# Altium project PCB_Project.PrjPcb
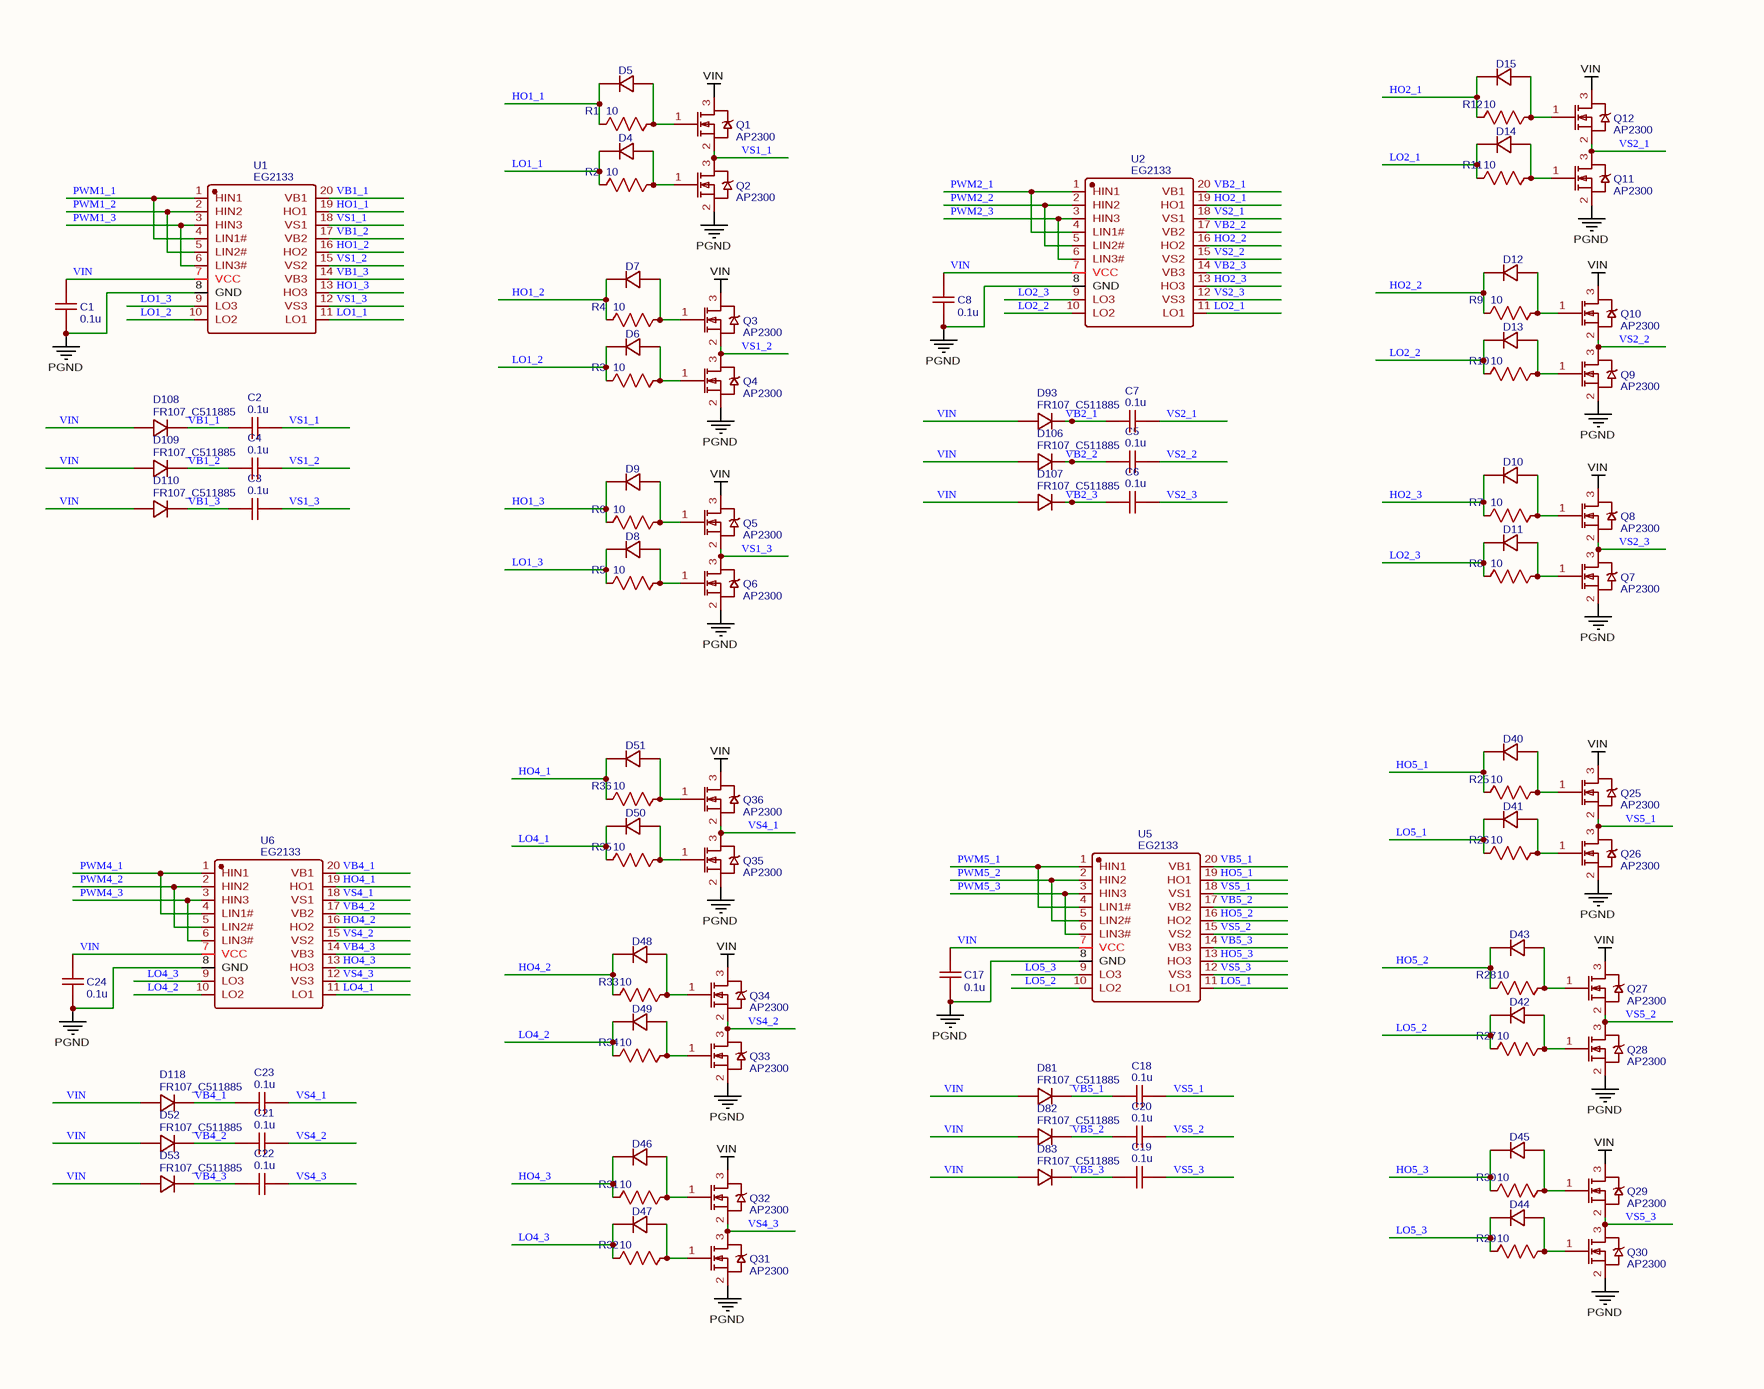
[diagram p0: quark_foc_driver.schdoc, top left]
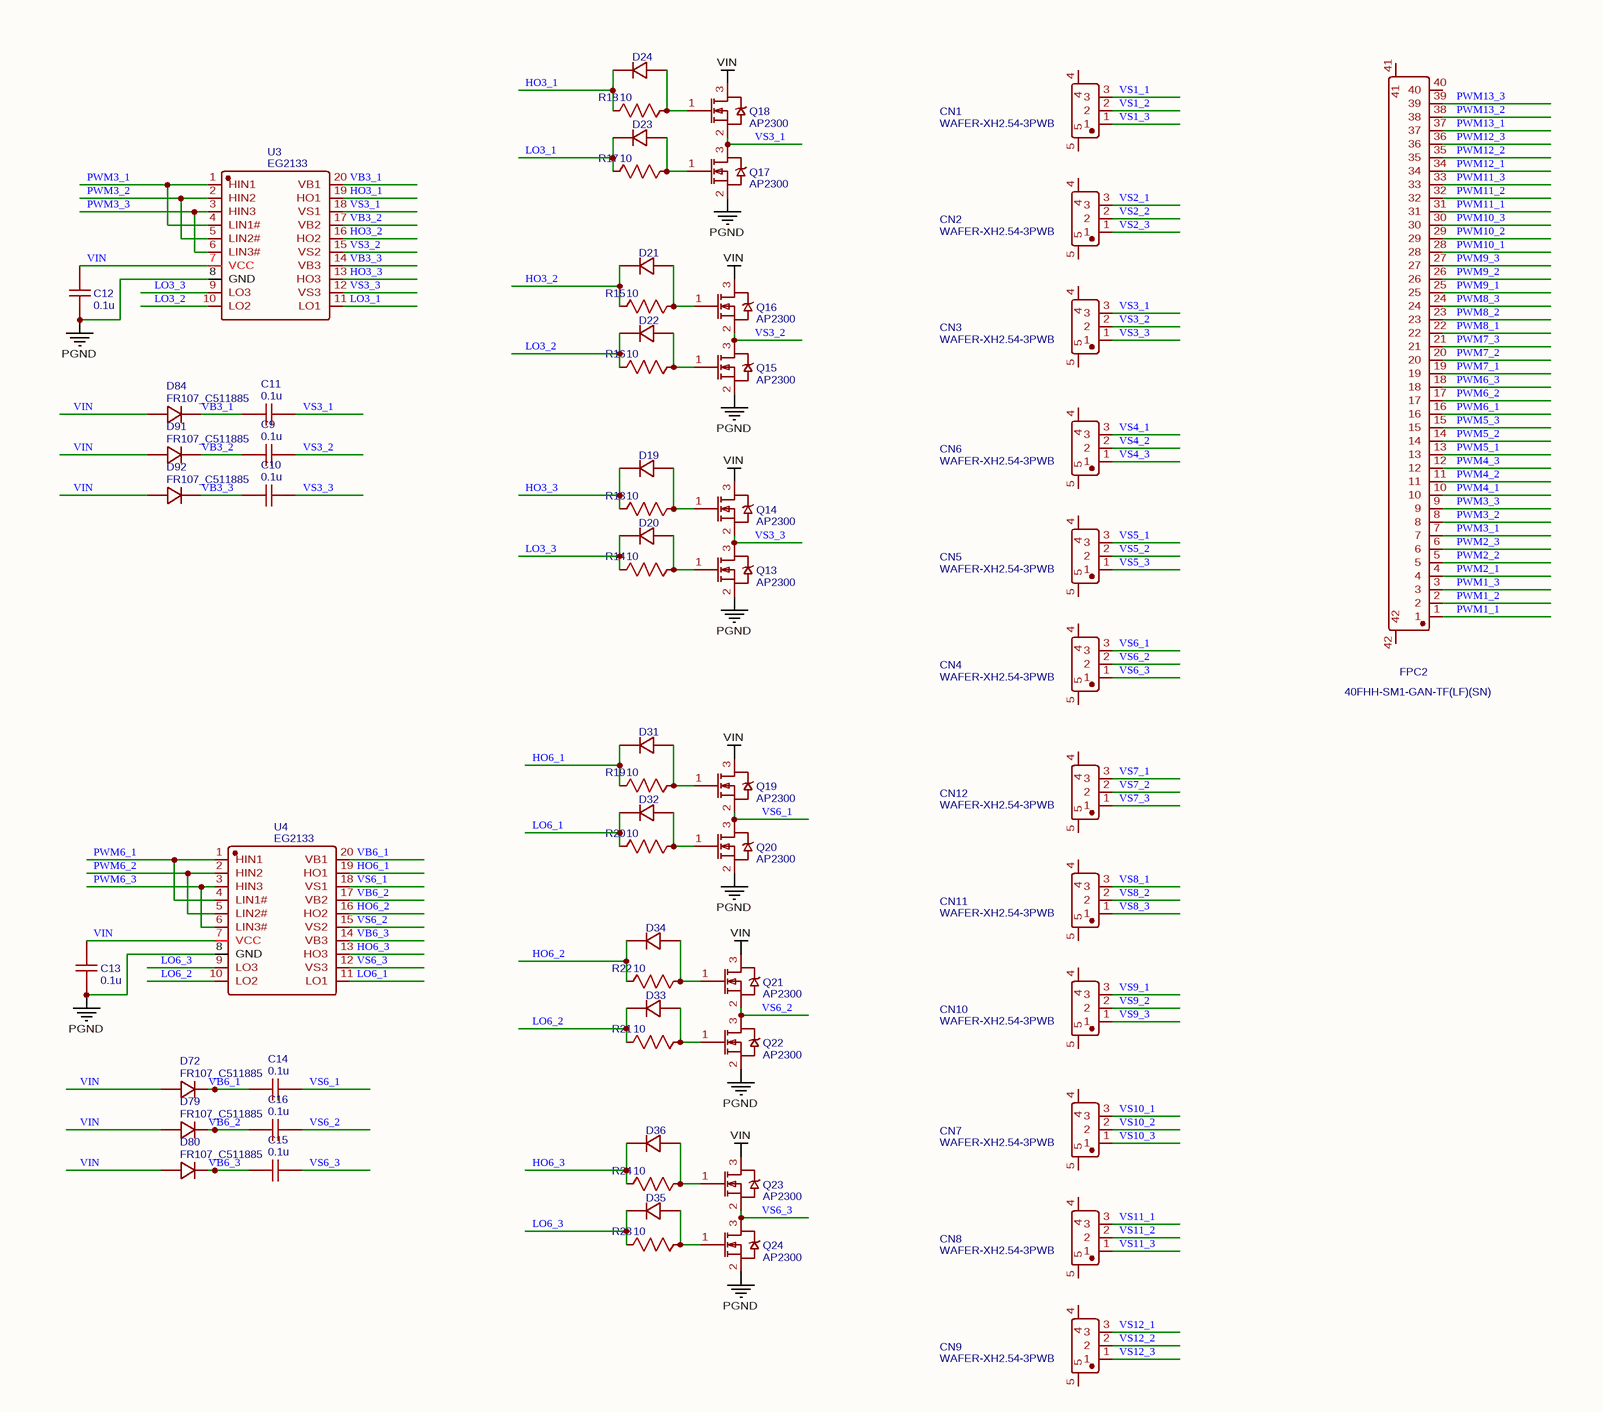
[diagram p1: quark_foc_driver.schdoc, top right]
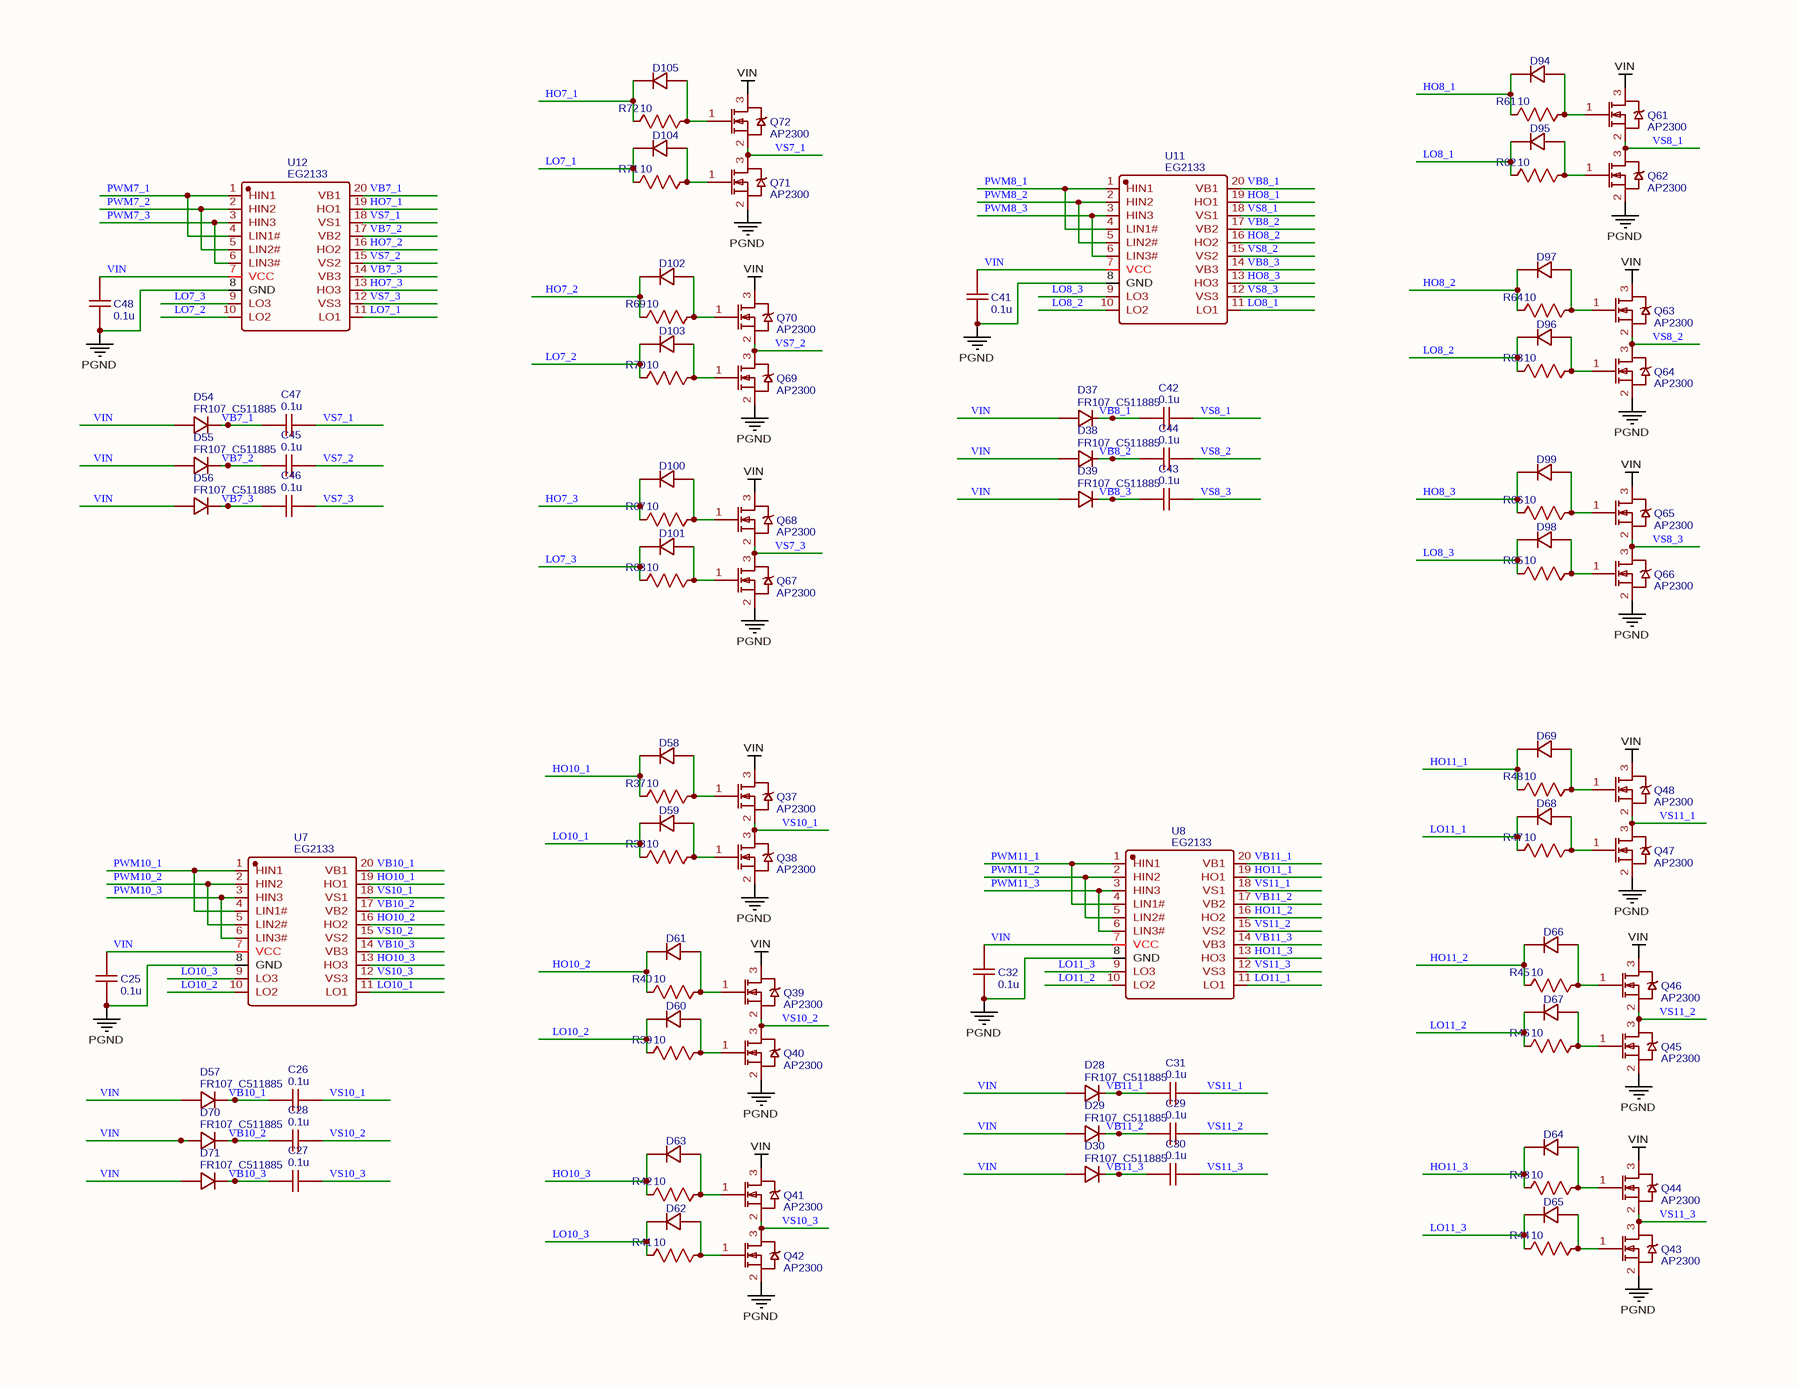
[diagram p2: quark_foc_driver.schdoc, bottom left]
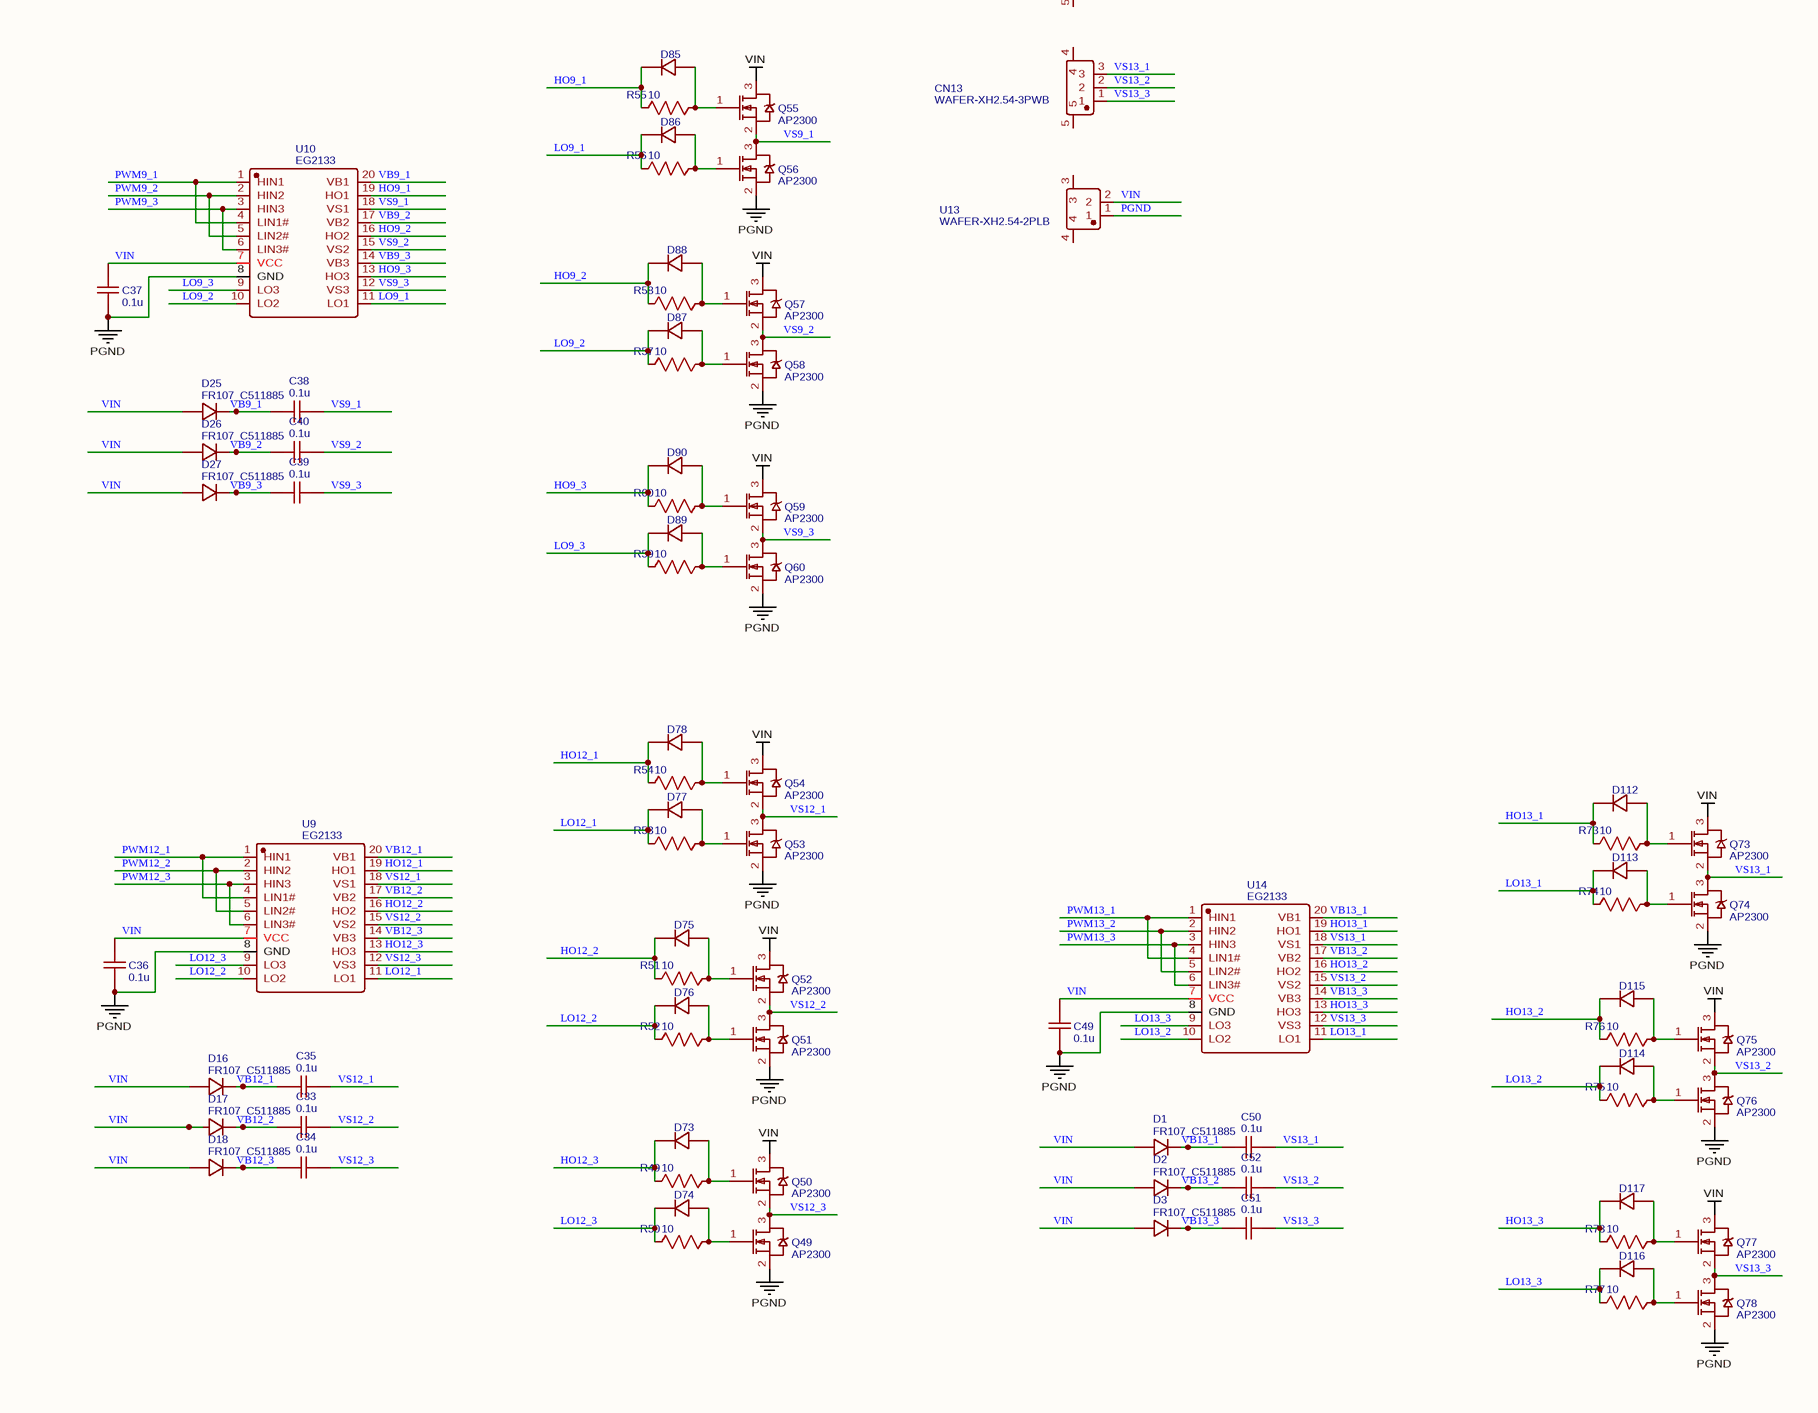
[diagram p3: quark_foc_driver.schdoc, bottom right]
1 sheet, 353 parts. Net scope: global (net labels, ports and power ports of the same name join across sheets).
Board file: quark_dog_driver.PcbDoc

## Sheet quark_foc_driver.schdoc
size 697 x 526 mm; SheetNumber: 1; SheetTotal: 1

### Parts
C1  0.1u  [C0603]
C2  0.1u  [C0603]
C3  0.1u  [C0603]
C4  0.1u  [C0603]
C5  0.1u  [C0603]
C6  0.1u  [C0603]
C7  0.1u  [C0603]
C8  0.1u  [C0603]
C9  0.1u  [C0603]
C10  0.1u  [C0603]
C11  0.1u  [C0603]
C12  0.1u  [C0603]
C13  0.1u  [C0603]
C14  0.1u  [C0603]
C15  0.1u  [C0603]
C16  0.1u  [C0603]
C17  0.1u  [C0603]
C18  0.1u  [C0603]
C19  0.1u  [C0603]
C20  0.1u  [C0603]
C21  0.1u  [C0603]
C22  0.1u  [C0603]
C23  0.1u  [C0603]
C24  0.1u  [C0603]
C25  0.1u  [C0603]
C26  0.1u  [C0603]
C27  0.1u  [C0603]
C28  0.1u  [C0603]
C29  0.1u  [C0603]
C30  0.1u  [C0603]
C31  0.1u  [C0603]
C32  0.1u  [C0603]
C33  0.1u  [C0603]
C34  0.1u  [C0603]
C35  0.1u  [C0603]
C36  0.1u  [C0603]
C37  0.1u  [C0603]
C38  0.1u  [C0603]
C39  0.1u  [C0603]
C40  0.1u  [C0603]
C41  0.1u  [C0603]
C42  0.1u  [C0603]
C43  0.1u  [C0603]
C44  0.1u  [C0603]
C45  0.1u  [C0603]
C46  0.1u  [C0603]
C47  0.1u  [C0603]
C48  0.1u  [C0603]
C49  0.1u  [C0603]
C50  0.1u  [C0603]
C51  0.1u  [C0603]
C52  0.1u  [C0603]
CN1  WAFER-XH2.54-3PWB  [CONN-SMD_3P-P2.50_XUNPU_WAFER-XH2.54-3PWB]
CN2  WAFER-XH2.54-3PWB  [CONN-SMD_3P-P2.50_XUNPU_WAFER-XH2.54-3PWB]
CN3  WAFER-XH2.54-3PWB  [CONN-SMD_3P-P2.50_XUNPU_WAFER-XH2.54-3PWB]
CN4  WAFER-XH2.54-3PWB  [CONN-SMD_3P-P2.50_XUNPU_WAFER-XH2.54-3PWB]
CN5  WAFER-XH2.54-3PWB  [CONN-SMD_3P-P2.50_XUNPU_WAFER-XH2.54-3PWB]
CN6  WAFER-XH2.54-3PWB  [CONN-SMD_3P-P2.50_XUNPU_WAFER-XH2.54-3PWB]
CN7  WAFER-XH2.54-3PWB  [CONN-SMD_3P-P2.50_XUNPU_WAFER-XH2.54-3PWB]
CN8  WAFER-XH2.54-3PWB  [CONN-SMD_3P-P2.50_XUNPU_WAFER-XH2.54-3PWB]
CN9  WAFER-XH2.54-3PWB  [CONN-SMD_3P-P2.50_XUNPU_WAFER-XH2.54-3PWB]
CN10  WAFER-XH2.54-3PWB  [CONN-SMD_3P-P2.50_XUNPU_WAFER-XH2.54-3PWB]
CN11  WAFER-XH2.54-3PWB  [CONN-SMD_3P-P2.50_XUNPU_WAFER-XH2.54-3PWB]
CN12  WAFER-XH2.54-3PWB  [CONN-SMD_3P-P2.50_XUNPU_WAFER-XH2.54-3PWB]
CN13  WAFER-XH2.54-3PWB  [CONN-SMD_3P-P2.50_XUNPU_WAFER-XH2.54-3PWB]
D1  FR107_C511885  [SOD-123_L2.8-W1.8-LS3.7-RD]
D2  FR107_C511885  [SOD-123_L2.8-W1.8-LS3.7-RD]
D3  FR107_C511885  [SOD-123_L2.8-W1.8-LS3.7-RD]
D4  1N4148W_C176288  [SOD-123_L2.8-W1.8-LS3.7-RD]  (value not drawn)
D5  1N4148W_C176288  [SOD-123_L2.8-W1.8-LS3.7-RD]  (value not drawn)
D6  1N4148W_C176288  [SOD-123_L2.8-W1.8-LS3.7-RD]  (value not drawn)
D7  1N4148W_C176288  [SOD-123_L2.8-W1.8-LS3.7-RD]  (value not drawn)
D8  1N4148W_C176288  [SOD-123_L2.8-W1.8-LS3.7-RD]  (value not drawn)
D9  1N4148W_C176288  [SOD-123_L2.8-W1.8-LS3.7-RD]  (value not drawn)
D10  1N4148W_C176288  [SOD-123_L2.8-W1.8-LS3.7-RD]  (value not drawn)
D11  1N4148W_C176288  [SOD-123_L2.8-W1.8-LS3.7-RD]  (value not drawn)
D12  1N4148W_C176288  [SOD-123_L2.8-W1.8-LS3.7-RD]  (value not drawn)
D13  1N4148W_C176288  [SOD-123_L2.8-W1.8-LS3.7-RD]  (value not drawn)
D14  1N4148W_C176288  [SOD-123_L2.8-W1.8-LS3.7-RD]  (value not drawn)
D15  1N4148W_C176288  [SOD-123_L2.8-W1.8-LS3.7-RD]  (value not drawn)
D16  FR107_C511885  [SOD-123_L2.8-W1.8-LS3.7-RD]
D17  FR107_C511885  [SOD-123_L2.8-W1.8-LS3.7-RD]
D18  FR107_C511885  [SOD-123_L2.8-W1.8-LS3.7-RD]
D19  1N4148W_C176288  [SOD-123_L2.8-W1.8-LS3.7-RD]  (value not drawn)
D20  1N4148W_C176288  [SOD-123_L2.8-W1.8-LS3.7-RD]  (value not drawn)
D21  1N4148W_C176288  [SOD-123_L2.8-W1.8-LS3.7-RD]  (value not drawn)
D22  1N4148W_C176288  [SOD-123_L2.8-W1.8-LS3.7-RD]  (value not drawn)
D23  1N4148W_C176288  [SOD-123_L2.8-W1.8-LS3.7-RD]  (value not drawn)
D24  1N4148W_C176288  [SOD-123_L2.8-W1.8-LS3.7-RD]  (value not drawn)
D25  FR107_C511885  [SOD-123_L2.8-W1.8-LS3.7-RD]
D26  FR107_C511885  [SOD-123_L2.8-W1.8-LS3.7-RD]
D27  FR107_C511885  [SOD-123_L2.8-W1.8-LS3.7-RD]
D28  FR107_C511885  [SOD-123_L2.8-W1.8-LS3.7-RD]
D29  FR107_C511885  [SOD-123_L2.8-W1.8-LS3.7-RD]
D30  FR107_C511885  [SOD-123_L2.8-W1.8-LS3.7-RD]
D31  1N4148W_C176288  [SOD-123_L2.8-W1.8-LS3.7-RD]  (value not drawn)
D32  1N4148W_C176288  [SOD-123_L2.8-W1.8-LS3.7-RD]  (value not drawn)
D33  1N4148W_C176288  [SOD-123_L2.8-W1.8-LS3.7-RD]  (value not drawn)
D34  1N4148W_C176288  [SOD-123_L2.8-W1.8-LS3.7-RD]  (value not drawn)
D35  1N4148W_C176288  [SOD-123_L2.8-W1.8-LS3.7-RD]  (value not drawn)
D36  1N4148W_C176288  [SOD-123_L2.8-W1.8-LS3.7-RD]  (value not drawn)
D37  FR107_C511885  [SOD-123_L2.8-W1.8-LS3.7-RD]
D38  FR107_C511885  [SOD-123_L2.8-W1.8-LS3.7-RD]
D39  FR107_C511885  [SOD-123_L2.8-W1.8-LS3.7-RD]
D40  1N4148W_C176288  [SOD-123_L2.8-W1.8-LS3.7-RD]  (value not drawn)
D41  1N4148W_C176288  [SOD-123_L2.8-W1.8-LS3.7-RD]  (value not drawn)
D42  1N4148W_C176288  [SOD-123_L2.8-W1.8-LS3.7-RD]  (value not drawn)
D43  1N4148W_C176288  [SOD-123_L2.8-W1.8-LS3.7-RD]  (value not drawn)
D44  1N4148W_C176288  [SOD-123_L2.8-W1.8-LS3.7-RD]  (value not drawn)
D45  1N4148W_C176288  [SOD-123_L2.8-W1.8-LS3.7-RD]  (value not drawn)
D46  1N4148W_C176288  [SOD-123_L2.8-W1.8-LS3.7-RD]  (value not drawn)
D47  1N4148W_C176288  [SOD-123_L2.8-W1.8-LS3.7-RD]  (value not drawn)
D48  1N4148W_C176288  [SOD-123_L2.8-W1.8-LS3.7-RD]  (value not drawn)
D49  1N4148W_C176288  [SOD-123_L2.8-W1.8-LS3.7-RD]  (value not drawn)
D50  1N4148W_C176288  [SOD-123_L2.8-W1.8-LS3.7-RD]  (value not drawn)
D51  1N4148W_C176288  [SOD-123_L2.8-W1.8-LS3.7-RD]  (value not drawn)
D52  FR107_C511885  [SOD-123_L2.8-W1.8-LS3.7-RD]
D53  FR107_C511885  [SOD-123_L2.8-W1.8-LS3.7-RD]
D54  FR107_C511885  [SOD-123_L2.8-W1.8-LS3.7-RD]
D55  FR107_C511885  [SOD-123_L2.8-W1.8-LS3.7-RD]
D56  FR107_C511885  [SOD-123_L2.8-W1.8-LS3.7-RD]
D57  FR107_C511885  [SOD-123_L2.8-W1.8-LS3.7-RD]
D58  1N4148W_C176288  [SOD-123_L2.8-W1.8-LS3.7-RD]  (value not drawn)
D59  1N4148W_C176288  [SOD-123_L2.8-W1.8-LS3.7-RD]  (value not drawn)
D60  1N4148W_C176288  [SOD-123_L2.8-W1.8-LS3.7-RD]  (value not drawn)
D61  1N4148W_C176288  [SOD-123_L2.8-W1.8-LS3.7-RD]  (value not drawn)
D62  1N4148W_C176288  [SOD-123_L2.8-W1.8-LS3.7-RD]  (value not drawn)
D63  1N4148W_C176288  [SOD-123_L2.8-W1.8-LS3.7-RD]  (value not drawn)
D64  1N4148W_C176288  [SOD-123_L2.8-W1.8-LS3.7-RD]  (value not drawn)
D65  1N4148W_C176288  [SOD-123_L2.8-W1.8-LS3.7-RD]  (value not drawn)
D66  1N4148W_C176288  [SOD-123_L2.8-W1.8-LS3.7-RD]  (value not drawn)
D67  1N4148W_C176288  [SOD-123_L2.8-W1.8-LS3.7-RD]  (value not drawn)
D68  1N4148W_C176288  [SOD-123_L2.8-W1.8-LS3.7-RD]  (value not drawn)
D69  1N4148W_C176288  [SOD-123_L2.8-W1.8-LS3.7-RD]  (value not drawn)
D70  FR107_C511885  [SOD-123_L2.8-W1.8-LS3.7-RD]
D71  FR107_C511885  [SOD-123_L2.8-W1.8-LS3.7-RD]
D72  FR107_C511885  [SOD-123_L2.8-W1.8-LS3.7-RD]
D73  1N4148W_C176288  [SOD-123_L2.8-W1.8-LS3.7-RD]  (value not drawn)
D74  1N4148W_C176288  [SOD-123_L2.8-W1.8-LS3.7-RD]  (value not drawn)
D75  1N4148W_C176288  [SOD-123_L2.8-W1.8-LS3.7-RD]  (value not drawn)
D76  1N4148W_C176288  [SOD-123_L2.8-W1.8-LS3.7-RD]  (value not drawn)
D77  1N4148W_C176288  [SOD-123_L2.8-W1.8-LS3.7-RD]  (value not drawn)
D78  1N4148W_C176288  [SOD-123_L2.8-W1.8-LS3.7-RD]  (value not drawn)
D79  FR107_C511885  [SOD-123_L2.8-W1.8-LS3.7-RD]
D80  FR107_C511885  [SOD-123_L2.8-W1.8-LS3.7-RD]
D81  FR107_C511885  [SOD-123_L2.8-W1.8-LS3.7-RD]
D82  FR107_C511885  [SOD-123_L2.8-W1.8-LS3.7-RD]
D83  FR107_C511885  [SOD-123_L2.8-W1.8-LS3.7-RD]
D84  FR107_C511885  [SOD-123_L2.8-W1.8-LS3.7-RD]
D85  1N4148W_C176288  [SOD-123_L2.8-W1.8-LS3.7-RD]  (value not drawn)
D86  1N4148W_C176288  [SOD-123_L2.8-W1.8-LS3.7-RD]  (value not drawn)
D87  1N4148W_C176288  [SOD-123_L2.8-W1.8-LS3.7-RD]  (value not drawn)
D88  1N4148W_C176288  [SOD-123_L2.8-W1.8-LS3.7-RD]  (value not drawn)
D89  1N4148W_C176288  [SOD-123_L2.8-W1.8-LS3.7-RD]  (value not drawn)
D90  1N4148W_C176288  [SOD-123_L2.8-W1.8-LS3.7-RD]  (value not drawn)
D91  FR107_C511885  [SOD-123_L2.8-W1.8-LS3.7-RD]
D92  FR107_C511885  [SOD-123_L2.8-W1.8-LS3.7-RD]
D93  FR107_C511885  [SOD-123_L2.8-W1.8-LS3.7-RD]
D94  1N4148W_C176288  [SOD-123_L2.8-W1.8-LS3.7-RD]  (value not drawn)
D95  1N4148W_C176288  [SOD-123_L2.8-W1.8-LS3.7-RD]  (value not drawn)
D96  1N4148W_C176288  [SOD-123_L2.8-W1.8-LS3.7-RD]  (value not drawn)
D97  1N4148W_C176288  [SOD-123_L2.8-W1.8-LS3.7-RD]  (value not drawn)
D98  1N4148W_C176288  [SOD-123_L2.8-W1.8-LS3.7-RD]  (value not drawn)
D99  1N4148W_C176288  [SOD-123_L2.8-W1.8-LS3.7-RD]  (value not drawn)
D100  1N4148W_C176288  [SOD-123_L2.8-W1.8-LS3.7-RD]  (value not drawn)
D101  1N4148W_C176288  [SOD-123_L2.8-W1.8-LS3.7-RD]  (value not drawn)
D102  1N4148W_C176288  [SOD-123_L2.8-W1.8-LS3.7-RD]  (value not drawn)
D103  1N4148W_C176288  [SOD-123_L2.8-W1.8-LS3.7-RD]  (value not drawn)
D104  1N4148W_C176288  [SOD-123_L2.8-W1.8-LS3.7-RD]  (value not drawn)
D105  1N4148W_C176288  [SOD-123_L2.8-W1.8-LS3.7-RD]  (value not drawn)
D106  FR107_C511885  [SOD-123_L2.8-W1.8-LS3.7-RD]
D107  FR107_C511885  [SOD-123_L2.8-W1.8-LS3.7-RD]
D108  FR107_C511885  [SOD-123_L2.8-W1.8-LS3.7-RD]
D109  FR107_C511885  [SOD-123_L2.8-W1.8-LS3.7-RD]
D110  FR107_C511885  [SOD-123_L2.8-W1.8-LS3.7-RD]
D112  1N4148W_C176288  [SOD-123_L2.8-W1.8-LS3.7-RD]  (value not drawn)
D113  1N4148W_C176288  [SOD-123_L2.8-W1.8-LS3.7-RD]  (value not drawn)
D114  1N4148W_C176288  [SOD-123_L2.8-W1.8-LS3.7-RD]  (value not drawn)
D115  1N4148W_C176288  [SOD-123_L2.8-W1.8-LS3.7-RD]  (value not drawn)
D116  1N4148W_C176288  [SOD-123_L2.8-W1.8-LS3.7-RD]  (value not drawn)
D117  1N4148W_C176288  [SOD-123_L2.8-W1.8-LS3.7-RD]  (value not drawn)
D118  FR107_C511885  [SOD-123_L2.8-W1.8-LS3.7-RD]
FPC2  40FHH-SM1-GAN-TF(LF)(SN)  [FPC-SMD_JST_40FHH-SM1-GAN-TF]
Q1  AP2300  [SOT-23-3_L2.9-W1.3-P0.95-LS2.4-BR]
Q2  AP2300  [SOT-23-3_L2.9-W1.3-P0.95-LS2.4-BR]
Q3  AP2300  [SOT-23-3_L2.9-W1.3-P0.95-LS2.4-BR]
Q4  AP2300  [SOT-23-3_L2.9-W1.3-P0.95-LS2.4-BR]
Q5  AP2300  [SOT-23-3_L2.9-W1.3-P0.95-LS2.4-BR]
Q6  AP2300  [SOT-23-3_L2.9-W1.3-P0.95-LS2.4-BR]
Q7  AP2300  [SOT-23-3_L2.9-W1.3-P0.95-LS2.4-BR]
Q8  AP2300  [SOT-23-3_L2.9-W1.3-P0.95-LS2.4-BR]
Q9  AP2300  [SOT-23-3_L2.9-W1.3-P0.95-LS2.4-BR]
Q10  AP2300  [SOT-23-3_L2.9-W1.3-P0.95-LS2.4-BR]
Q11  AP2300  [SOT-23-3_L2.9-W1.3-P0.95-LS2.4-BR]
Q12  AP2300  [SOT-23-3_L2.9-W1.3-P0.95-LS2.4-BR]
Q13  AP2300  [SOT-23-3_L2.9-W1.3-P0.95-LS2.4-BR]
Q14  AP2300  [SOT-23-3_L2.9-W1.3-P0.95-LS2.4-BR]
Q15  AP2300  [SOT-23-3_L2.9-W1.3-P0.95-LS2.4-BR]
Q16  AP2300  [SOT-23-3_L2.9-W1.3-P0.95-LS2.4-BR]
Q17  AP2300  [SOT-23-3_L2.9-W1.3-P0.95-LS2.4-BR]
Q18  AP2300  [SOT-23-3_L2.9-W1.3-P0.95-LS2.4-BR]
Q19  AP2300  [SOT-23-3_L2.9-W1.3-P0.95-LS2.4-BR]
Q20  AP2300  [SOT-23-3_L2.9-W1.3-P0.95-LS2.4-BR]
Q21  AP2300  [SOT-23-3_L2.9-W1.3-P0.95-LS2.4-BR]
Q22  AP2300  [SOT-23-3_L2.9-W1.3-P0.95-LS2.4-BR]
Q23  AP2300  [SOT-23-3_L2.9-W1.3-P0.95-LS2.4-BR]
Q24  AP2300  [SOT-23-3_L2.9-W1.3-P0.95-LS2.4-BR]
Q25  AP2300  [SOT-23-3_L2.9-W1.3-P0.95-LS2.4-BR]
Q26  AP2300  [SOT-23-3_L2.9-W1.3-P0.95-LS2.4-BR]
Q27  AP2300  [SOT-23-3_L2.9-W1.3-P0.95-LS2.4-BR]
Q28  AP2300  [SOT-23-3_L2.9-W1.3-P0.95-LS2.4-BR]
Q29  AP2300  [SOT-23-3_L2.9-W1.3-P0.95-LS2.4-BR]
Q30  AP2300  [SOT-23-3_L2.9-W1.3-P0.95-LS2.4-BR]
Q31  AP2300  [SOT-23-3_L2.9-W1.3-P0.95-LS2.4-BR]
Q32  AP2300  [SOT-23-3_L2.9-W1.3-P0.95-LS2.4-BR]
Q33  AP2300  [SOT-23-3_L2.9-W1.3-P0.95-LS2.4-BR]
Q34  AP2300  [SOT-23-3_L2.9-W1.3-P0.95-LS2.4-BR]
Q35  AP2300  [SOT-23-3_L2.9-W1.3-P0.95-LS2.4-BR]
Q36  AP2300  [SOT-23-3_L2.9-W1.3-P0.95-LS2.4-BR]
Q37  AP2300  [SOT-23-3_L2.9-W1.3-P0.95-LS2.4-BR]
Q38  AP2300  [SOT-23-3_L2.9-W1.3-P0.95-LS2.4-BR]
Q39  AP2300  [SOT-23-3_L2.9-W1.3-P0.95-LS2.4-BR]
Q40  AP2300  [SOT-23-3_L2.9-W1.3-P0.95-LS2.4-BR]
Q41  AP2300  [SOT-23-3_L2.9-W1.3-P0.95-LS2.4-BR]
Q42  AP2300  [SOT-23-3_L2.9-W1.3-P0.95-LS2.4-BR]
Q43  AP2300  [SOT-23-3_L2.9-W1.3-P0.95-LS2.4-BR]
Q44  AP2300  [SOT-23-3_L2.9-W1.3-P0.95-LS2.4-BR]
Q45  AP2300  [SOT-23-3_L2.9-W1.3-P0.95-LS2.4-BR]
Q46  AP2300  [SOT-23-3_L2.9-W1.3-P0.95-LS2.4-BR]
Q47  AP2300  [SOT-23-3_L2.9-W1.3-P0.95-LS2.4-BR]
Q48  AP2300  [SOT-23-3_L2.9-W1.3-P0.95-LS2.4-BR]
Q49  AP2300  [SOT-23-3_L2.9-W1.3-P0.95-LS2.4-BR]
Q50  AP2300  [SOT-23-3_L2.9-W1.3-P0.95-LS2.4-BR]
Q51  AP2300  [SOT-23-3_L2.9-W1.3-P0.95-LS2.4-BR]
Q52  AP2300  [SOT-23-3_L2.9-W1.3-P0.95-LS2.4-BR]
Q53  AP2300  [SOT-23-3_L2.9-W1.3-P0.95-LS2.4-BR]
Q54  AP2300  [SOT-23-3_L2.9-W1.3-P0.95-LS2.4-BR]
Q55  AP2300  [SOT-23-3_L2.9-W1.3-P0.95-LS2.4-BR]
Q56  AP2300  [SOT-23-3_L2.9-W1.3-P0.95-LS2.4-BR]
Q57  AP2300  [SOT-23-3_L2.9-W1.3-P0.95-LS2.4-BR]
Q58  AP2300  [SOT-23-3_L2.9-W1.3-P0.95-LS2.4-BR]
Q59  AP2300  [SOT-23-3_L2.9-W1.3-P0.95-LS2.4-BR]
Q60  AP2300  [SOT-23-3_L2.9-W1.3-P0.95-LS2.4-BR]
Q61  AP2300  [SOT-23-3_L2.9-W1.3-P0.95-LS2.4-BR]
Q62  AP2300  [SOT-23-3_L2.9-W1.3-P0.95-LS2.4-BR]
Q63  AP2300  [SOT-23-3_L2.9-W1.3-P0.95-LS2.4-BR]
Q64  AP2300  [SOT-23-3_L2.9-W1.3-P0.95-LS2.4-BR]
Q65  AP2300  [SOT-23-3_L2.9-W1.3-P0.95-LS2.4-BR]
Q66  AP2300  [SOT-23-3_L2.9-W1.3-P0.95-LS2.4-BR]
Q67  AP2300  [SOT-23-3_L2.9-W1.3-P0.95-LS2.4-BR]
Q68  AP2300  [SOT-23-3_L2.9-W1.3-P0.95-LS2.4-BR]
Q69  AP2300  [SOT-23-3_L2.9-W1.3-P0.95-LS2.4-BR]
Q70  AP2300  [SOT-23-3_L2.9-W1.3-P0.95-LS2.4-BR]
Q71  AP2300  [SOT-23-3_L2.9-W1.3-P0.95-LS2.4-BR]
Q72  AP2300  [SOT-23-3_L2.9-W1.3-P0.95-LS2.4-BR]
Q73  AP2300  [SOT-23-3_L2.9-W1.3-P0.95-LS2.4-BR]
Q74  AP2300  [SOT-23-3_L2.9-W1.3-P0.95-LS2.4-BR]
Q75  AP2300  [SOT-23-3_L2.9-W1.3-P0.95-LS2.4-BR]
Q76  AP2300  [SOT-23-3_L2.9-W1.3-P0.95-LS2.4-BR]
Q77  AP2300  [SOT-23-3_L2.9-W1.3-P0.95-LS2.4-BR]
Q78  AP2300  [SOT-23-3_L2.9-W1.3-P0.95-LS2.4-BR]
R1  10  [R0402]
R2  10  [R0402]
R3  10  [R0402]
R4  10  [R0402]
R5  10  [R0402]
R6  10  [R0402]
R7  10  [R0402]
R8  10  [R0402]
R9  10  [R0402]
R10  10  [R0402]
R11  10  [R0402]
R12  10  [R0402]
R13  10  [R0402]
R14  10  [R0402]
R15  10  [R0402]
R16  10  [R0402]
R17  10  [R0402]
R18  10  [R0402]
R19  10  [R0402]
R20  10  [R0402]
R21  10  [R0402]
R22  10  [R0402]
R23  10  [R0402]
R24  10  [R0402]
R25  10  [R0402]
R26  10  [R0402]
R27  10  [R0402]
R28  10  [R0402]
R29  10  [R0402]
R30  10  [R0402]
R31  10  [R0402]
R32  10  [R0402]
R33  10  [R0402]
R34  10  [R0402]
R35  10  [R0402]
R36  10  [R0402]
R37  10  [R0402]
R38  10  [R0402]
R39  10  [R0402]
R40  10  [R0402]
R41  10  [R0402]
R42  10  [R0402]
R43  10  [R0402]
R44  10  [R0402]
R45  10  [R0402]
R46  10  [R0402]
R47  10  [R0402]
R48  10  [R0402]
R49  10  [R0402]
R50  10  [R0402]
R51  10  [R0402]
R52  10  [R0402]
R53  10  [R0402]
R54  10  [R0402]
R55  10  [R0402]
R56  10  [R0402]
R57  10  [R0402]
R58  10  [R0402]
R59  10  [R0402]
R60  10  [R0402]
R61  10  [R0402]
R62  10  [R0402]
R63  10  [R0402]
R64  10  [R0402]
R65  10  [R0402]
R66  10  [R0402]
R67  10  [R0402]
R68  10  [R0402]
R69  10  [R0402]
R70  10  [R0402]
R71  10  [R0402]
R72  10  [R0402]
R73  10  [R0402]
R74  10  [R0402]
R75  10  [R0402]
R76  10  [R0402]
R77  10  [R0402]
R78  10  [R0402]
U1  EG2133  [TSSOP-20_L6.5-W4.4-P0.65-LS6.4-BL]
U2  EG2133  [TSSOP-20_L6.5-W4.4-P0.65-LS6.4-BL]
U3  EG2133  [TSSOP-20_L6.5-W4.4-P0.65-LS6.4-BL]
U4  EG2133  [TSSOP-20_L6.5-W4.4-P0.65-LS6.4-BL]
U5  EG2133  [TSSOP-20_L6.5-W4.4-P0.65-LS6.4-BL]
U6  EG2133  [TSSOP-20_L6.5-W4.4-P0.65-LS6.4-BL]
U7  EG2133  [TSSOP-20_L6.5-W4.4-P0.65-LS6.4-BL]
U8  EG2133  [TSSOP-20_L6.5-W4.4-P0.65-LS6.4-BL]
U9  EG2133  [TSSOP-20_L6.5-W4.4-P0.65-LS6.4-BL]
U10  EG2133  [TSSOP-20_L6.5-W4.4-P0.65-LS6.4-BL]
U11  EG2133  [TSSOP-20_L6.5-W4.4-P0.65-LS6.4-BL]
U12  EG2133  [TSSOP-20_L6.5-W4.4-P0.65-LS6.4-BL]
U13  WAFER-XH2.54-2PLB  [CONN-SMD_2P-P2.50_XUNPU_WAFER-XH2.54-2PLB]
U14  EG2133  [TSSOP-20_L6.5-W4.4-P0.65-LS6.4-BL]

### Nets
PGND: C1.1 C8.1 C12.1 C13.1 C17.1 C24.1 C25.1 C32.1 C36.1 C37.1 C41.1 C48.1 C49.1 Q2.2(S) Q4.2(S) Q6.2(S) Q7.2(S) Q9.2(S) Q11.2(S) Q13.2(S) Q15.2(S) Q17.2(S) Q20.2(S) Q22.2(S) Q24.2(S) Q26.2(S) Q28.2(S) Q30.2(S) Q31.2(S) Q33.2(S) Q35.2(S) Q38.2(S) Q40.2(S) Q42.2(S) Q43.2(S) Q45.2(S) Q47.2(S) Q49.2(S) Q51.2(S) Q53.2(S) Q56.2(S) Q58.2(S) Q60.2(S) Q62.2(S) Q64.2(S) Q66.2(S) Q67.2(S) Q69.2(S) Q71.2(S) Q74.2(S) Q76.2(S) Q78.2(S) U1.8(GND) U2.8(GND) U3.8(GND) U4.8(GND) U5.8(GND) U6.8(GND) U7.8(GND) U8.8(GND) U9.8(GND) U10.8(GND) U11.8(GND) U12.8(GND) U13.1 U14.8(GND)
VIN: C1.2 C8.2 C12.2 C13.2 C17.2 C24.2 C25.2 C32.2 C36.2 C37.2 C41.2 C48.2 C49.2 D1.2(A) D2.2(A) D3.2(A) D16.2(A) D17.2(A) D18.2(A) D25.2(A) D26.2(A) D27.2(A) D28.2(A) D29.2(A) D30.2(A) D37.2(A) D38.2(A) D39.2(A) D52.2(A) D53.2(A) D54.2(A) D55.2(A) D56.2(A) D57.2(A) D70.2(A) D71.2(A) D72.2(A) D79.2(A) D80.2(A) D81.2(A) D82.2(A) D83.2(A) D84.2(A) D91.2(A) D92.2(A) D93.2(A) D106.2(A) D107.2(A) D108.2(A) D109.2(A) D110.2(A) D118.2(A) Q1.3(D) Q3.3(D) Q5.3(D) Q8.3(D) Q10.3(D) Q12.3(D) Q14.3(D) Q16.3(D) Q18.3(D) Q19.3(D) Q21.3(D) Q23.3(D) Q25.3(D) Q27.3(D) Q29.3(D) Q32.3(D) Q34.3(D) Q36.3(D) Q37.3(D) Q39.3(D) Q41.3(D) Q44.3(D) Q46.3(D) Q48.3(D) Q50.3(D) Q52.3(D) Q54.3(D) Q55.3(D) Q57.3(D) Q59.3(D) Q61.3(D) Q63.3(D) Q65.3(D) Q68.3(D) Q70.3(D) Q72.3(D) Q73.3(D) Q75.3(D) Q77.3(D) U1.7(VCC) U2.7(VCC) U3.7(VCC) U4.7(VCC) U5.7(VCC) U6.7(VCC) U7.7(VCC) U8.7(VCC) U9.7(VCC) U10.7(VCC) U11.7(VCC) U12.7(VCC) U13.2 U14.7(VCC)
HO1_1: D5.1(C) R1.1 U1.19(HO1)
HO1_2: D7.1(C) R4.1 U1.16(HO2)
HO1_3: D9.1(C) R6.1 U1.13(HO3)
HO2_1: D15.1(C) R12.1 U2.19(HO1)
HO2_2: D12.1(C) R9.1 U2.16(HO2)
HO2_3: D10.1(C) R7.1 U2.13(HO3)
HO3_1: D24.1(C) R18.1 U3.19(HO1)
HO3_2: D21.1(C) R15.1 U3.16(HO2)
HO3_3: D19.1(C) R13.1 U3.13(HO3)
HO4_1: D51.1(C) R36.1 U6.19(HO1)
HO4_2: D48.1(C) R33.1 U6.16(HO2)
HO4_3: D46.1(C) R31.1 U6.13(HO3)
HO5_1: D40.1(C) R25.1 U5.19(HO1)
HO5_2: D43.1(C) R28.1 U5.16(HO2)
HO5_3: D45.1(C) R30.1 U5.13(HO3)
HO6_1: D31.1(C) R19.1 U4.19(HO1)
HO6_2: D34.1(C) R22.1 U4.16(HO2)
HO6_3: D36.1(C) R24.1 U4.13(HO3)
HO7_1: D105.1(C) R72.1 U12.19(HO1)
HO7_2: D102.1(C) R69.1 U12.16(HO2)
HO7_3: D100.1(C) R67.1 U12.13(HO3)
HO8_1: D94.1(C) R61.1 U11.19(HO1)
HO8_2: D97.1(C) R64.1 U11.16(HO2)
HO8_3: D99.1(C) R66.1 U11.13(HO3)
HO9_1: D85.1(C) R55.1 U10.19(HO1)
HO9_2: D88.1(C) R58.1 U10.16(HO2)
HO9_3: D90.1(C) R60.1 U10.13(HO3)
HO10_1: D58.1(C) R37.1 U7.19(HO1)
HO10_2: D61.1(C) R40.1 U7.16(HO2)
HO10_3: D63.1(C) R42.1 U7.13(HO3)
HO11_1: D69.1(C) R48.1 U8.19(HO1)
HO11_2: D66.1(C) R45.1 U8.16(HO2)
HO11_3: D64.1(C) R43.1 U8.13(HO3)
HO12_1: D78.1(C) R54.1 U9.19(HO1)
HO12_2: D75.1(C) R51.1 U9.16(HO2)
HO12_3: D73.1(C) R49.1 U9.13(HO3)
HO13_1: D112.1(C) R73.1 U14.19(HO1)
HO13_2: D115.1(C) R76.1 U14.16(HO2)
HO13_3: D117.1(C) R78.1 U14.13(HO3)
LO1_1: D4.1(C) R2.1 U1.11(LO1)
LO1_2: D6.1(C) R3.1 U1.10(LO2)
LO1_3: D8.1(C) R5.1 U1.9(LO3)
LO2_1: D14.1(C) R11.1 U2.11(LO1)
LO2_2: D13.1(C) R10.1 U2.10(LO2)
LO2_3: D11.1(C) R8.1 U2.9(LO3)
LO3_1: D23.1(C) R17.1 U3.11(LO1)
LO3_2: D22.1(C) R16.1 U3.10(LO2)
LO3_3: D20.1(C) R14.1 U3.9(LO3)
LO4_1: D50.1(C) R35.1 U6.11(LO1)
LO4_2: D49.1(C) R34.1 U6.10(LO2)
LO4_3: D47.1(C) R32.1 U6.9(LO3)
LO5_1: D41.1(C) R26.1 U5.11(LO1)
LO5_2: D42.1(C) R27.1 U5.10(LO2)
LO5_3: D44.1(C) R29.1 U5.9(LO3)
LO6_1: D32.1(C) R20.1 U4.11(LO1)
LO6_2: D33.1(C) R21.1 U4.10(LO2)
LO6_3: D35.1(C) R23.1 U4.9(LO3)
LO7_1: D104.1(C) R71.1 U12.11(LO1)
LO7_2: D103.1(C) R70.1 U12.10(LO2)
LO7_3: D101.1(C) R68.1 U12.9(LO3)
LO8_1: D95.1(C) R62.1 U11.11(LO1)
LO8_2: D96.1(C) R63.1 U11.10(LO2)
LO8_3: D98.1(C) R65.1 U11.9(LO3)
LO9_1: D86.1(C) R56.1 U10.11(LO1)
LO9_2: D87.1(C) R57.1 U10.10(LO2)
LO9_3: D89.1(C) R59.1 U10.9(LO3)
LO10_1: D59.1(C) R38.1 U7.11(LO1)
LO10_2: D60.1(C) R39.1 U7.10(LO2)
LO10_3: D62.1(C) R41.1 U7.9(LO3)
LO11_1: D68.1(C) R47.1 U8.11(LO1)
LO11_2: D67.1(C) R46.1 U8.10(LO2)
LO11_3: D65.1(C) R44.1 U8.9(LO3)
LO12_1: D77.1(C) R53.1 U9.11(LO1)
LO12_2: D76.1(C) R52.1 U9.10(LO2)
LO12_3: D74.1(C) R50.1 U9.9(LO3)
LO13_1: D113.1(C) R74.1 U14.11(LO1)
LO13_2: D114.1(C) R75.1 U14.10(LO2)
LO13_3: D116.1(C) R77.1 U14.9(LO3)
PWM1_1: FPC2.1 U1.1(HIN1) U1.4(LIN1#)
PWM1_2: FPC2.2 U1.2(HIN2) U1.5(LIN2#)
PWM1_3: FPC2.3 U1.3(HIN3) U1.6(LIN3#)
PWM2_1: FPC2.4 U2.1(HIN1) U2.4(LIN1#)
PWM2_2: FPC2.5 U2.2(HIN2) U2.5(LIN2#)
PWM2_3: FPC2.6 U2.3(HIN3) U2.6(LIN3#)
PWM3_1: FPC2.7 U3.1(HIN1) U3.4(LIN1#)
PWM3_2: FPC2.8 U3.2(HIN2) U3.5(LIN2#)
PWM3_3: FPC2.9 U3.3(HIN3) U3.6(LIN3#)
PWM4_1: FPC2.10 U6.1(HIN1) U6.4(LIN1#)
PWM4_2: FPC2.11 U6.2(HIN2) U6.5(LIN2#)
PWM4_3: FPC2.12 U6.3(HIN3) U6.6(LIN3#)
PWM5_1: FPC2.13 U5.1(HIN1) U5.4(LIN1#)
PWM5_2: FPC2.14 U5.2(HIN2) U5.5(LIN2#)
PWM5_3: FPC2.15 U5.3(HIN3) U5.6(LIN3#)
PWM6_1: FPC2.16 U4.1(HIN1) U4.4(LIN1#)
PWM6_2: FPC2.17 U4.2(HIN2) U4.5(LIN2#)
PWM6_3: FPC2.18 U4.3(HIN3) U4.6(LIN3#)
PWM7_1: FPC2.19 U12.1(HIN1) U12.4(LIN1#)
PWM7_2: FPC2.20 U12.2(HIN2) U12.5(LIN2#)
PWM7_3: FPC2.21 U12.3(HIN3) U12.6(LIN3#)
PWM8_1: FPC2.22 U11.1(HIN1) U11.4(LIN1#)
PWM8_2: FPC2.23 U11.2(HIN2) U11.5(LIN2#)
PWM8_3: FPC2.24 U11.3(HIN3) U11.6(LIN3#)
PWM9_1: FPC2.25 U10.1(HIN1) U10.4(LIN1#)
PWM9_2: FPC2.26 U10.2(HIN2) U10.5(LIN2#)
PWM9_3: FPC2.27 U10.3(HIN3) U10.6(LIN3#)
PWM10_1: FPC2.28 U7.1(HIN1) U7.4(LIN1#)
PWM10_2: FPC2.29 U7.2(HIN2) U7.5(LIN2#)
PWM10_3: FPC2.30 U7.3(HIN3) U7.6(LIN3#)
PWM11_1: FPC2.31 U8.1(HIN1) U8.4(LIN1#)
PWM11_2: FPC2.32 U8.2(HIN2) U8.5(LIN2#)
PWM11_3: FPC2.33 U8.3(HIN3) U8.6(LIN3#)
PWM12_1: FPC2.34 U9.1(HIN1) U9.4(LIN1#)
PWM12_2: FPC2.35 U9.2(HIN2) U9.5(LIN2#)
PWM12_3: FPC2.36 U9.3(HIN3) U9.6(LIN3#)
PWM13_1: FPC2.37 U14.1(HIN1) U14.4(LIN1#)
PWM13_2: FPC2.38 U14.2(HIN2) U14.5(LIN2#)
PWM13_3: FPC2.39 U14.3(HIN3) U14.6(LIN3#)
VB1_1: C2.1 D108.1(K) U1.20(VB1)
VB1_2: C4.2 D109.1(K) U1.17(VB2)
VB1_3: C3.1 D110.1(K) U1.14(VB3)
VB2_1: C7.1 D93.1(K) U2.20(VB1)
VB2_2: C5.2 D106.1(K) U2.17(VB2)
VB2_3: C6.1 D107.1(K) U2.14(VB3)
VB3_1: C11.1 D84.1(K) U3.20(VB1)
VB3_2: C9.2 D91.1(K) U3.17(VB2)
VB3_3: C10.1 D92.1(K) U3.14(VB3)
VB4_1: C23.1 D118.1(K) U6.20(VB1)
VB4_2: C21.2 D52.1(K) U6.17(VB2)
VB4_3: C22.1 D53.1(K) U6.14(VB3)
VB5_1: C18.1 D81.1(K) U5.20(VB1)
VB5_2: C20.2 D82.1(K) U5.17(VB2)
VB5_3: C19.1 D83.1(K) U5.14(VB3)
VB6_1: C14.1 D72.1(K) U4.20(VB1)
VB6_2: C16.2 D79.1(K) U4.17(VB2)
VB6_3: C15.1 D80.1(K) U4.14(VB3)
VB7_1: C47.1 D54.1(K) U12.20(VB1)
VB7_2: C45.2 D55.1(K) U12.17(VB2)
VB7_3: C46.1 D56.1(K) U12.14(VB3)
VB8_1: C42.1 D37.1(K) U11.20(VB1)
VB8_2: C44.2 D38.1(K) U11.17(VB2)
VB8_3: C43.1 D39.1(K) U11.14(VB3)
VB9_1: C38.1 D25.1(K) U10.20(VB1)
VB9_2: C40.2 D26.1(K) U10.17(VB2)
VB9_3: C39.1 D27.1(K) U10.14(VB3)
VB10_1: C26.1 D57.1(K) U7.20(VB1)
VB10_2: C28.2 D70.1(K) U7.17(VB2)
VB10_3: C27.1 D71.1(K) U7.14(VB3)
VB11_1: C31.1 D28.1(K) U8.20(VB1)
VB11_2: C29.2 D29.1(K) U8.17(VB2)
VB11_3: C30.1 D30.1(K) U8.14(VB3)
VB12_1: C35.1 D16.1(K) U9.20(VB1)
VB12_2: C33.2 D17.1(K) U9.17(VB2)
VB12_3: C34.1 D18.1(K) U9.14(VB3)
VB13_1: C50.1 D1.1(K) U14.20(VB1)
VB13_2: C52.2 D2.1(K) U14.17(VB2)
VB13_3: C51.1 D3.1(K) U14.14(VB3)
VS1_1: C2.2 CN1.3 Q1.2(S) Q2.3(D) U1.18(VS1)
VS1_2: C4.1 CN1.2 Q3.2(S) Q4.3(D) U1.15(VS2)
VS1_3: C3.2 CN1.1 Q5.2(S) Q6.3(D) U1.12(VS3)
VS2_1: C7.2 CN2.3 Q11.3(D) Q12.2(S) U2.18(VS1)
VS2_2: C5.1 CN2.2 Q9.3(D) Q10.2(S) U2.15(VS2)
VS2_3: C6.2 CN2.1 Q7.3(D) Q8.2(S) U2.12(VS3)
VS3_1: C11.2 CN3.3 Q17.3(D) Q18.2(S) U3.18(VS1)
VS3_2: C9.1 CN3.2 Q15.3(D) Q16.2(S) U3.15(VS2)
VS3_3: C10.2 CN3.1 Q13.3(D) Q14.2(S) U3.12(VS3)
VS4_1: C23.2 CN6.3 Q35.3(D) Q36.2(S) U6.18(VS1)
VS4_2: C21.1 CN6.2 Q33.3(D) Q34.2(S) U6.15(VS2)
VS4_3: C22.2 CN6.1 Q31.3(D) Q32.2(S) U6.12(VS3)
VS5_1: C18.2 CN5.3 Q25.2(S) Q26.3(D) U5.18(VS1)
VS5_2: C20.1 CN5.2 Q27.2(S) Q28.3(D) U5.15(VS2)
VS5_3: C19.2 CN5.1 Q29.2(S) Q30.3(D) U5.12(VS3)
VS6_1: C14.2 CN4.3 Q19.2(S) Q20.3(D) U4.18(VS1)
VS6_2: C16.1 CN4.2 Q21.2(S) Q22.3(D) U4.15(VS2)
VS6_3: C15.2 CN4.1 Q23.2(S) Q24.3(D) U4.12(VS3)
VS7_1: C47.2 CN12.3 Q71.3(D) Q72.2(S) U12.18(VS1)
VS7_2: C45.1 CN12.2 Q69.3(D) Q70.2(S) U12.15(VS2)
VS7_3: C46.2 CN12.1 Q67.3(D) Q68.2(S) U12.12(VS3)
VS8_1: C42.2 CN11.3 Q61.2(S) Q62.3(D) U11.18(VS1)
VS8_2: C44.1 CN11.2 Q63.2(S) Q64.3(D) U11.15(VS2)
VS8_3: C43.2 CN11.1 Q65.2(S) Q66.3(D) U11.12(VS3)
VS9_1: C38.2 CN10.3 Q55.2(S) Q56.3(D) U10.18(VS1)
VS9_2: C40.1 CN10.2 Q57.2(S) Q58.3(D) U10.15(VS2)
VS9_3: C39.2 CN10.1 Q59.2(S) Q60.3(D) U10.12(VS3)
VS10_1: C26.2 CN7.3 Q37.2(S) Q38.3(D) U7.18(VS1)
VS10_2: C28.1 CN7.2 Q39.2(S) Q40.3(D) U7.15(VS2)
VS10_3: C27.2 CN7.1 Q41.2(S) Q42.3(D) U7.12(VS3)
VS11_1: C31.2 CN8.3 Q47.3(D) Q48.2(S) U8.18(VS1)
VS11_2: C29.1 CN8.2 Q45.3(D) Q46.2(S) U8.15(VS2)
VS11_3: C30.2 CN8.1 Q43.3(D) Q44.2(S) U8.12(VS3)
VS12_1: C35.2 CN9.3 Q53.3(D) Q54.2(S) U9.18(VS1)
VS12_2: C33.1 CN9.2 Q51.3(D) Q52.2(S) U9.15(VS2)
VS12_3: C34.2 CN9.1 Q49.3(D) Q50.2(S) U9.12(VS3)
VS13_1: C50.2 CN13.3 Q73.2(S) Q74.3(D) U14.18(VS1)
VS13_2: C52.1 CN13.2 Q75.2(S) Q76.3(D) U14.15(VS2)
VS13_3: C51.2 CN13.1 Q77.2(S) Q78.3(D) U14.12(VS3)
NetD4_2: D4.2(A) Q2.1(G) R2.2
NetD5_2: D5.2(A) Q1.1(G) R1.2
NetD6_2: D6.2(A) Q4.1(G) R3.2
NetD7_2: D7.2(A) Q3.1(G) R4.2
NetD8_2: D8.2(A) Q6.1(G) R5.2
NetD9_2: D9.2(A) Q5.1(G) R6.2
NetD10_2: D10.2(A) Q8.1(G) R7.2
NetD11_2: D11.2(A) Q7.1(G) R8.2
NetD12_2: D12.2(A) Q10.1(G) R9.2
NetD13_2: D13.2(A) Q9.1(G) R10.2
NetD14_2: D14.2(A) Q11.1(G) R11.2
NetD15_2: D15.2(A) Q12.1(G) R12.2
NetD19_2: D19.2(A) Q14.1(G) R13.2
NetD20_2: D20.2(A) Q13.1(G) R14.2
NetD21_2: D21.2(A) Q16.1(G) R15.2
NetD22_2: D22.2(A) Q15.1(G) R16.2
NetD23_2: D23.2(A) Q17.1(G) R17.2
NetD24_2: D24.2(A) Q18.1(G) R18.2
NetD31_2: D31.2(A) Q19.1(G) R19.2
NetD32_2: D32.2(A) Q20.1(G) R20.2
NetD33_2: D33.2(A) Q22.1(G) R21.2
NetD34_2: D34.2(A) Q21.1(G) R22.2
NetD35_2: D35.2(A) Q24.1(G) R23.2
NetD36_2: D36.2(A) Q23.1(G) R24.2
NetD40_2: D40.2(A) Q25.1(G) R25.2
NetD41_2: D41.2(A) Q26.1(G) R26.2
NetD42_2: D42.2(A) Q28.1(G) R27.2
NetD43_2: D43.2(A) Q27.1(G) R28.2
NetD44_2: D44.2(A) Q30.1(G) R29.2
NetD45_2: D45.2(A) Q29.1(G) R30.2
NetD46_2: D46.2(A) Q32.1(G) R31.2
NetD47_2: D47.2(A) Q31.1(G) R32.2
NetD48_2: D48.2(A) Q34.1(G) R33.2
NetD49_2: D49.2(A) Q33.1(G) R34.2
NetD50_2: D50.2(A) Q35.1(G) R35.2
NetD51_2: D51.2(A) Q36.1(G) R36.2
NetD58_2: D58.2(A) Q37.1(G) R37.2
NetD59_2: D59.2(A) Q38.1(G) R38.2
NetD60_2: D60.2(A) Q40.1(G) R39.2
NetD61_2: D61.2(A) Q39.1(G) R40.2
NetD62_2: D62.2(A) Q42.1(G) R41.2
NetD63_2: D63.2(A) Q41.1(G) R42.2
NetD64_2: D64.2(A) Q44.1(G) R43.2
NetD65_2: D65.2(A) Q43.1(G) R44.2
NetD66_2: D66.2(A) Q46.1(G) R45.2
NetD67_2: D67.2(A) Q45.1(G) R46.2
NetD68_2: D68.2(A) Q47.1(G) R47.2
NetD69_2: D69.2(A) Q48.1(G) R48.2
NetD73_2: D73.2(A) Q50.1(G) R49.2
NetD74_2: D74.2(A) Q49.1(G) R50.2
NetD75_2: D75.2(A) Q52.1(G) R51.2
NetD76_2: D76.2(A) Q51.1(G) R52.2
NetD77_2: D77.2(A) Q53.1(G) R53.2
NetD78_2: D78.2(A) Q54.1(G) R54.2
NetD85_2: D85.2(A) Q55.1(G) R55.2
NetD86_2: D86.2(A) Q56.1(G) R56.2
NetD87_2: D87.2(A) Q58.1(G) R57.2
NetD88_2: D88.2(A) Q57.1(G) R58.2
NetD89_2: D89.2(A) Q60.1(G) R59.2
NetD90_2: D90.2(A) Q59.1(G) R60.2
NetD94_2: D94.2(A) Q61.1(G) R61.2
NetD95_2: D95.2(A) Q62.1(G) R62.2
NetD96_2: D96.2(A) Q64.1(G) R63.2
NetD97_2: D97.2(A) Q63.1(G) R64.2
NetD98_2: D98.2(A) Q66.1(G) R65.2
NetD99_2: D99.2(A) Q65.1(G) R66.2
NetD100_2: D100.2(A) Q68.1(G) R67.2
NetD101_2: D101.2(A) Q67.1(G) R68.2
NetD102_2: D102.2(A) Q70.1(G) R69.2
NetD103_2: D103.2(A) Q69.1(G) R70.2
NetD104_2: D104.2(A) Q71.1(G) R71.2
NetD105_2: D105.2(A) Q72.1(G) R72.2
NetD112_2: D112.2(A) Q73.1(G) R73.2
NetD113_2: D113.2(A) Q74.1(G) R74.2
NetD114_2: D114.2(A) Q76.1(G) R75.2
NetD115_2: D115.2(A) Q75.1(G) R76.2
NetD116_2: D116.2(A) Q78.1(G) R77.2
NetD117_2: D117.2(A) Q77.1(G) R78.2

Not connected (* = marked no-connect by the designer): CN1 4 5; CN2 4 5; CN3 4 5; CN4 4 5; CN5 4 5; CN6 4 5; CN7 4 5; CN8 4 5; CN9 4 5; CN10 4 5; CN11 4 5; CN12 4 5; CN13 4 5; FPC2 40 41 42; U13 3 4

### Library data of the parts
C1-C52 = 0.1u: nameAlias: Value(F); Contributor: LCEDA_Lib; spicePre: C; spiceSymbolName: C_0603_US
CN1-CN13 = WAFER-XH2.54-3PWB: BOM_Manufacturer: XUNPU(讯普); Contributor: lcsc; BOM_Supplier: LCSC; BOM_Supplier Part: C3029477; BOM_Manufacturer Part: WAFER-XH2.54-3PWB; link: https://atta.szlcsc.com/upload/public/pdf/source/20220527/7ACD2214A426F03D9ACD52F5A71E518C.pdf; BOM_JLCPCB Part Class: Extended Part; spicePre: C; spiceSymbolName: WAFER-XH2.54-3PWB
D1-D3 D16-D18 D25-D30 D37-D39 D52-D57 D70-D72 D79-D84 D91-D93 D106-D110 D118 = FR107_C511885: BOM_Manufacturer: Bourne Semicon (Shenzhen); BOM_Manufacturer Part: FR107; Contributor: LCSC; BOM_Supplier: LCSC; BOM_Supplier Part: C511885; BOM_JLCPCB Part Class: Extended Part; spicePre: D; spiceSymbolName: FR107_C511885
D4-D15 D19-D24 D31-D36 D40-D51 D58-D69 D73-D78 D85-D90 D94-D105 D112-D117 = 1N4148W_C176288: BOM_Manufacturer: Sangdest Microelectronicstronic (Nanjing); Contributor: LCSC; BOM_Supplier: LCSC; BOM_Supplier Part: C176288; BOM_Manufacturer Part: 1N4148W; BOM_JLCPCB Part Class: Extended Part; spicePre: D; spiceSymbolName: 1N4148W_C176288
FPC2 = 40FHH-SM1-GAN-TF(LF)(SN): BOM_Manufacturer: JST; Contributor: LCSC; BOM_Supplier: LCSC; BOM_Supplier Part: C593938; BOM_Manufacturer Part: 40FHH-SM1-GAN-TF(LF)(SN); link: https://atta.szlcsc.com//upload/public/pdf/source/20220125/5516BF2D32C3CEE5060B2D9C1CC5588E.pdf; BOM_JLCPCB Part Class: Extended Part; spicePre: F; spiceSymbolName: 40FHH-SM1-GAN-TF(LF)(SN)
Q1-Q78 = AP2300: BOM_Manufacturer: ShenZhen Quan Li Semiconductor; Contributor: LCSC; BOM_Supplier: LCSC; BOM_Supplier Part: C360338; BOM_Manufacturer Part: AP2300; BOM_JLCPCB Part Class: Extended Part; spicePre: Q; spiceSymbolName: AP2300
R1-R78 = 10: nameAlias: Value(Ω); Contributor: LCEDA_Lib; spicePre: R; spiceSymbolName: R_0603_US
U1-U12 U14 = EG2133: BOM_Manufacturer: EG Micro; Contributor: LCSC; BOM_Supplier: LCSC; BOM_Supplier Part: C190343; BOM_Manufacturer Part: EG2133; BOM_JLCPCB Part Class: Extended Part; spicePre: U; spiceSymbolName: EG2133
U13 = WAFER-XH2.54-2PLB: BOM_Manufacturer: XUNPU(讯普); Contributor: lcsc; BOM_Supplier: LCSC; BOM_Supplier Part: C3029467; BOM_Manufacturer Part: WAFER-XH2.54-2PLB; link: https://atta.szlcsc.com/upload/public/pdf/source/20220527/139842C6548CEDBA8D9F0F4A441614CD.pdf; BOM_JLCPCB Part Class: Extended Part; spicePre: U; spiceSymbolName: WAFER-XH2.54-2PLB